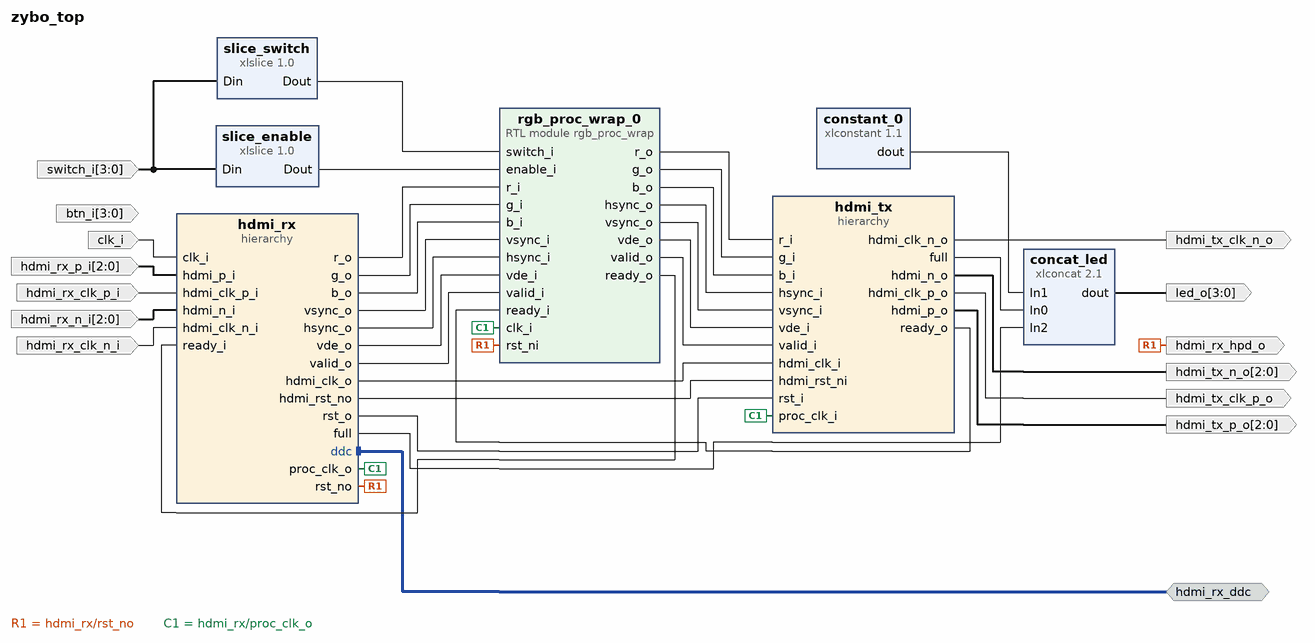
[diagram p0: block diagram of the top level]
# Vivado block design zybo_top, xc7z020clg400-1, Vivado 2017.2
create_bd_design zybo_top

create_bd_intf_port -mode Master -vlnv xilinx.com:interface:iic_rtl:1.0 hdmi_rx_ddc
create_bd_port -dir I -from 3 -to 0 switch_i
create_bd_port -dir I -from 3 -to 0 btn_i
create_bd_port -dir O -from 3 -to 0 led_o
create_bd_port -dir I -type clk clk_i
set_property -dict {CONFIG.FREQ_HZ 125000000} [get_bd_ports clk_i]
create_bd_port -dir I -from 2 -to 0 hdmi_rx_p_i
create_bd_port -dir I hdmi_rx_clk_p_i
create_bd_port -dir I -from 2 -to 0 hdmi_rx_n_i
create_bd_port -dir I hdmi_rx_clk_n_i
create_bd_port -dir O hdmi_rx_hpd_o
create_bd_port -dir O hdmi_tx_clk_n_o
create_bd_port -dir O -from 2 -to 0 hdmi_tx_n_o
create_bd_port -dir O -from 2 -to 0 hdmi_tx_p_o
create_bd_port -dir O hdmi_tx_clk_p_o

create_bd_cell -type hier hdmi_rx
create_bd_cell -type hier hdmi_tx
create_bd_cell -type ip -vlnv xilinx.com:ip:xlconcat:2.1 concat_led
set_property -dict {CONFIG.NUM_PORTS 3 CONFIG.IN1_WIDTH 2} [get_bd_cells concat_led]
create_bd_cell -type ip -vlnv xilinx.com:ip:xlconstant:1.1 constant_0
set_property -dict {CONFIG.CONST_WIDTH 2 CONFIG.CONST_VAL 0} [get_bd_cells constant_0]
create_bd_cell -type module -reference rgb_proc_wrap rgb_proc_wrap_0
create_bd_cell -type ip -vlnv xilinx.com:ip:xlslice:1.0 slice_enable
set_property -dict {CONFIG.DIN_TO 3 CONFIG.DIN_FROM 3 CONFIG.DIN_WIDTH 4 CONFIG.DOUT_WIDTH 1} [get_bd_cells slice_enable]
create_bd_cell -type ip -vlnv xilinx.com:ip:xlslice:1.0 slice_switch
set_property -dict {CONFIG.DIN_TO 0 CONFIG.DIN_FROM 2 CONFIG.DIN_WIDTH 4 CONFIG.DOUT_WIDTH 3} [get_bd_cells slice_switch]

# ---- hierarchy /hdmi_rx ----
current_bd_instance /hdmi_rx
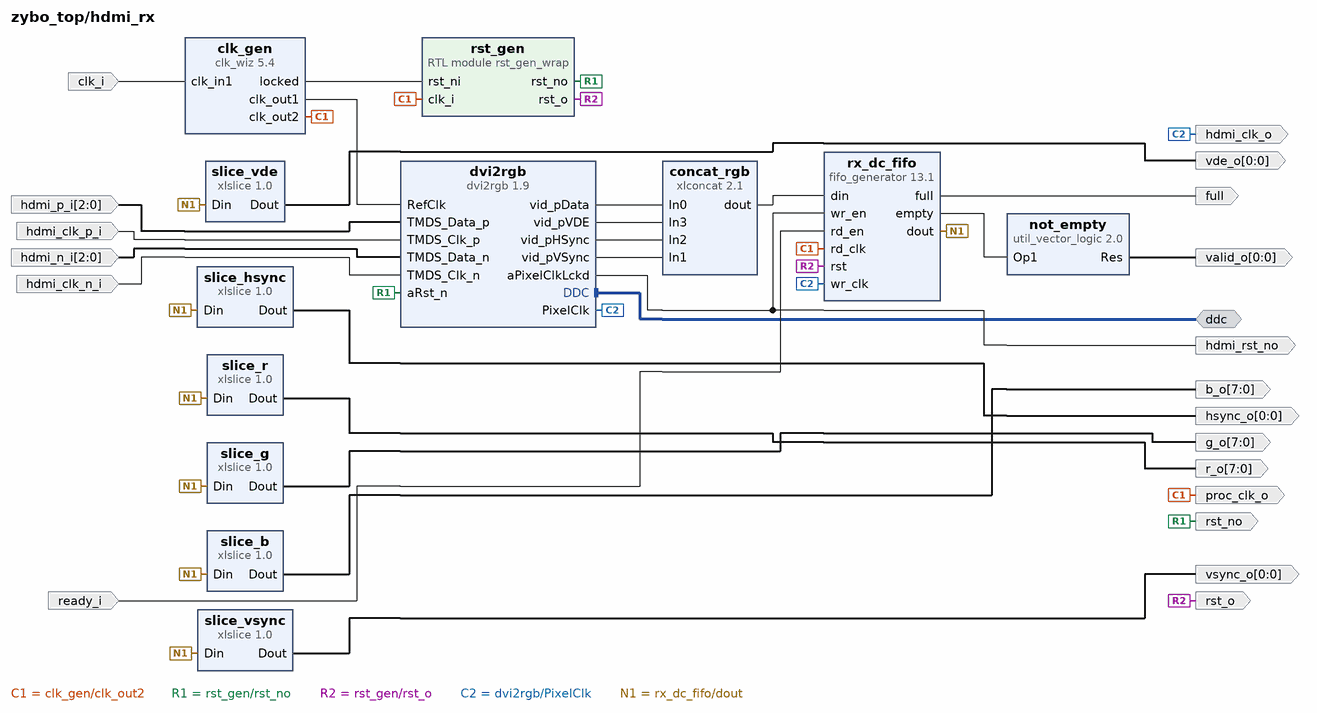
[diagram p1: block diagram inside /hdmi_rx]
create_bd_intf_pin -mode Master -vlnv xilinx.com:interface:iic_rtl:1.0 ddc
create_bd_pin -dir I clk_i
create_bd_pin -dir I -from 2 -to 0 hdmi_p_i
create_bd_pin -dir I hdmi_clk_p_i
create_bd_pin -dir I -from 2 -to 0 hdmi_n_i
create_bd_pin -dir I hdmi_clk_n_i
create_bd_pin -dir I ready_i
create_bd_pin -dir O proc_clk_o
create_bd_pin -dir O hdmi_clk_o
create_bd_pin -dir O hdmi_rst_no
create_bd_pin -dir O -from 0 -to 0 valid_o
create_bd_pin -dir O rst_o
create_bd_pin -dir O rst_no
create_bd_pin -dir O -from 7 -to 0 r_o
create_bd_pin -dir O -from 7 -to 0 g_o
create_bd_pin -dir O -from 7 -to 0 b_o
create_bd_pin -dir O -from 0 -to 0 vsync_o
create_bd_pin -dir O -from 0 -to 0 hsync_o
create_bd_pin -dir O -from 0 -to 0 vde_o
create_bd_pin -dir O full

create_bd_cell -type ip -vlnv xilinx.com:ip:clk_wiz:5.4 clk_gen
set_property -dict [list \
  CONFIG.PRIMITIVE PLL \
  CONFIG.PRIM_IN_FREQ 125 \
  CONFIG.CLKIN1_JITTER_PS 80.0 \
  CONFIG.CLKOUT2_USED true \
  CONFIG.NUM_OUT_CLKS 2 \
  CONFIG.CLKOUT1_REQUESTED_OUT_FREQ 200.000 \
  CONFIG.CLKOUT2_REQUESTED_OUT_FREQ 150.000 \
  CONFIG.CLKOUT1_DRIVES BUFG \
  CONFIG.FEEDBACK_SOURCE FDBK_AUTO \
  CONFIG.USE_RESET false \
  CONFIG.MMCM_DIVCLK_DIVIDE 5 \
  CONFIG.MMCM_CLKFBOUT_MULT_F 48 \
  CONFIG.MMCM_CLKIN1_PERIOD 8.000 \
  CONFIG.MMCM_CLKIN2_PERIOD 10.000 \
  CONFIG.MMCM_COMPENSATION ZHOLD \
  CONFIG.MMCM_CLKOUT0_DIVIDE_F 6 \
  CONFIG.CLKOUT1_JITTER 161.296 \
  CONFIG.CLKOUT1_PHASE_ERROR 222.305 \
  CONFIG.CLKOUT2_JITTER 168.006 \
  CONFIG.CLKOUT2_PHASE_ERROR 222.305 \
] [get_bd_cells clk_gen]
create_bd_cell -type module -reference rst_gen_wrap rst_gen
create_bd_cell -type ip -vlnv digilentinc.com:ip:dvi2rgb:1.9 dvi2rgb
set_property -dict {CONFIG.kRstActiveHigh false CONFIG.kClkRange 1 CONFIG.kEdidFileName dgl_1080p_cea.data} [get_bd_cells dvi2rgb]
create_bd_cell -type ip -vlnv xilinx.com:ip:xlconcat:2.1 concat_rgb
set_property -dict {CONFIG.NUM_PORTS 4 CONFIG.IN0_WIDTH 24} [get_bd_cells concat_rgb]
create_bd_cell -type ip -vlnv xilinx.com:ip:xlslice:1.0 slice_r
set_property -dict {CONFIG.DIN_TO 16 CONFIG.DIN_FROM 23 CONFIG.DIN_WIDTH 27 CONFIG.DOUT_WIDTH 8} [get_bd_cells slice_r]
create_bd_cell -type ip -vlnv xilinx.com:ip:xlslice:1.0 slice_hsync
set_property -dict {CONFIG.DIN_TO 25 CONFIG.DIN_FROM 25 CONFIG.DIN_WIDTH 27 CONFIG.DOUT_WIDTH 1} [get_bd_cells slice_hsync]
create_bd_cell -type ip -vlnv xilinx.com:ip:xlslice:1.0 slice_vsync
set_property -dict {CONFIG.DIN_TO 24 CONFIG.DIN_FROM 24 CONFIG.DIN_WIDTH 27 CONFIG.DOUT_WIDTH 1} [get_bd_cells slice_vsync]
create_bd_cell -type ip -vlnv xilinx.com:ip:xlslice:1.0 slice_vde
set_property -dict {CONFIG.DIN_TO 26 CONFIG.DIN_FROM 26 CONFIG.DIN_WIDTH 27 CONFIG.DOUT_WIDTH 1} [get_bd_cells slice_vde]
create_bd_cell -type ip -vlnv xilinx.com:ip:xlslice:1.0 slice_g
set_property -dict {CONFIG.DIN_TO 8 CONFIG.DIN_FROM 15 CONFIG.DIN_WIDTH 27 CONFIG.DOUT_WIDTH 8} [get_bd_cells slice_g]
create_bd_cell -type ip -vlnv xilinx.com:ip:xlslice:1.0 slice_b
set_property -dict {CONFIG.DIN_TO 0 CONFIG.DIN_FROM 7 CONFIG.DIN_WIDTH 27 CONFIG.DOUT_WIDTH 8} [get_bd_cells slice_b]
create_bd_cell -type ip -vlnv xilinx.com:ip:fifo_generator:13.1 rx_dc_fifo
set_property -dict [list \
  CONFIG.Fifo_Implementation Independent_Clocks_Builtin_FIFO \
  CONFIG.Input_Data_Width 27 \
  CONFIG.Input_Depth 512 \
  CONFIG.Read_Clock_Frequency 150 \
  CONFIG.Write_Clock_Frequency 100 \
] [get_bd_cells rx_dc_fifo]
create_bd_cell -type ip -vlnv xilinx.com:ip:util_vector_logic:2.0 not_empty
set_property -dict {CONFIG.C_SIZE 1 CONFIG.C_OPERATION not} [get_bd_cells not_empty]

# ---- hierarchy /hdmi_tx ----
current_bd_instance /hdmi_tx
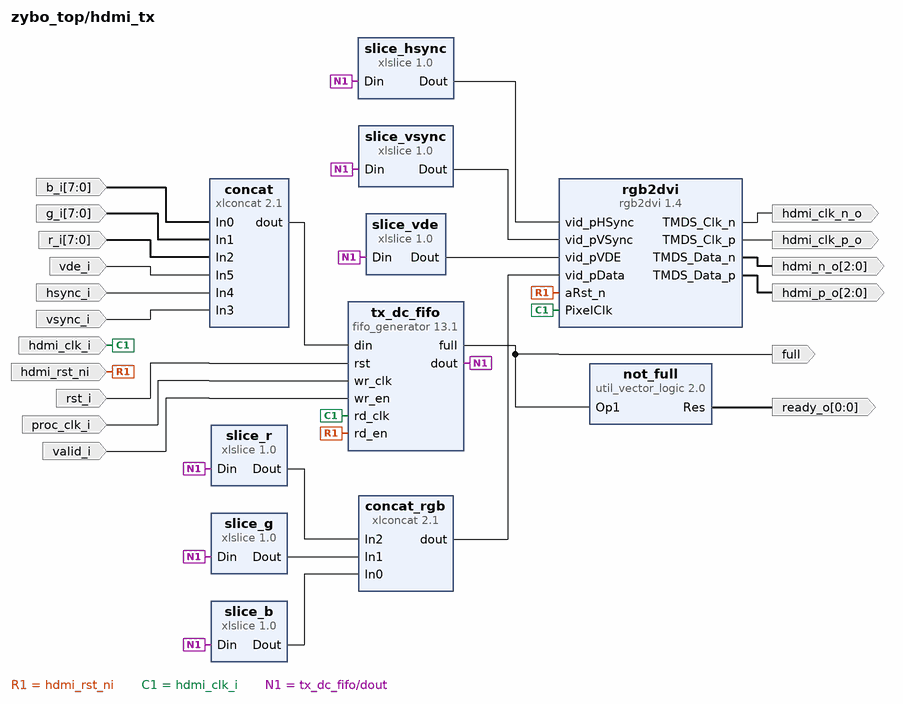
[diagram p2: block diagram inside /hdmi_tx]
create_bd_pin -dir I rst_i
create_bd_pin -dir I proc_clk_i
create_bd_pin -dir I hdmi_clk_i
create_bd_pin -dir I hdmi_rst_ni
create_bd_pin -dir I -from 7 -to 0 r_i
create_bd_pin -dir I -from 7 -to 0 g_i
create_bd_pin -dir I -from 7 -to 0 b_i
create_bd_pin -dir I vsync_i
create_bd_pin -dir I hsync_i
create_bd_pin -dir I vde_i
create_bd_pin -dir I valid_i
create_bd_pin -dir O -from 0 -to 0 ready_o
create_bd_pin -dir O hdmi_clk_n_o
create_bd_pin -dir O -from 2 -to 0 hdmi_n_o
create_bd_pin -dir O hdmi_clk_p_o
create_bd_pin -dir O -from 2 -to 0 hdmi_p_o
create_bd_pin -dir O full

create_bd_cell -type ip -vlnv digilentinc.com:ip:rgb2dvi:1.4 rgb2dvi
set_property -dict {CONFIG.kRstActiveHigh false CONFIG.kClkPrimitive MMCM} [get_bd_cells rgb2dvi]
create_bd_cell -type ip -vlnv xilinx.com:ip:xlconcat:2.1 concat
set_property -dict {CONFIG.NUM_PORTS 6 CONFIG.IN0_WIDTH 8 CONFIG.IN1_WIDTH 8 CONFIG.IN2_WIDTH 8} [get_bd_cells concat]
create_bd_cell -type ip -vlnv xilinx.com:ip:xlslice:1.0 slice_vde
set_property -dict {CONFIG.DIN_TO 26 CONFIG.DIN_FROM 26 CONFIG.DIN_WIDTH 27 CONFIG.DOUT_WIDTH 1} [get_bd_cells slice_vde]
create_bd_cell -type ip -vlnv xilinx.com:ip:xlslice:1.0 slice_hsync
set_property -dict {CONFIG.DIN_TO 25 CONFIG.DIN_FROM 25 CONFIG.DIN_WIDTH 27 CONFIG.DOUT_WIDTH 1} [get_bd_cells slice_hsync]
create_bd_cell -type ip -vlnv xilinx.com:ip:xlslice:1.0 slice_vsync
set_property -dict {CONFIG.DIN_TO 24 CONFIG.DIN_FROM 24 CONFIG.DIN_WIDTH 27 CONFIG.DOUT_WIDTH 1} [get_bd_cells slice_vsync]
create_bd_cell -type ip -vlnv xilinx.com:ip:xlslice:1.0 slice_r
set_property -dict {CONFIG.DIN_TO 16 CONFIG.DIN_FROM 23 CONFIG.DIN_WIDTH 27 CONFIG.DOUT_WIDTH 8} [get_bd_cells slice_r]
create_bd_cell -type ip -vlnv xilinx.com:ip:xlslice:1.0 slice_g
set_property -dict {CONFIG.DIN_TO 8 CONFIG.DIN_FROM 15 CONFIG.DIN_WIDTH 27 CONFIG.DOUT_WIDTH 8} [get_bd_cells slice_g]
create_bd_cell -type ip -vlnv xilinx.com:ip:xlslice:1.0 slice_b
set_property -dict {CONFIG.DIN_TO 0 CONFIG.DIN_FROM 7 CONFIG.DIN_WIDTH 27 CONFIG.DOUT_WIDTH 8} [get_bd_cells slice_b]
create_bd_cell -type ip -vlnv xilinx.com:ip:xlconcat:2.1 concat_rgb
set_property -dict {CONFIG.NUM_PORTS 3 CONFIG.IN0_WIDTH 8 CONFIG.IN1_WIDTH 8 CONFIG.IN2_WIDTH 8} [get_bd_cells concat_rgb]
create_bd_cell -type ip -vlnv xilinx.com:ip:fifo_generator:13.1 tx_dc_fifo
set_property -dict [list \
  CONFIG.Fifo_Implementation Independent_Clocks_Builtin_FIFO \
  CONFIG.Input_Data_Width 27 \
  CONFIG.Input_Depth 512 \
  CONFIG.Read_Clock_Frequency 100 \
  CONFIG.Write_Clock_Frequency 150 \
] [get_bd_cells tx_dc_fifo]
create_bd_cell -type ip -vlnv xilinx.com:ip:util_vector_logic:2.0 not_full
set_property -dict {CONFIG.C_SIZE 1 CONFIG.C_OPERATION not} [get_bd_cells not_full]

# ---- connections ----

current_bd_instance /hdmi_rx
connect_bd_intf_net [get_bd_intf_pins ddc] [get_bd_intf_pins dvi2rgb/DDC]
connect_bd_net [get_bd_pins clk_i] [get_bd_pins clk_gen/clk_in1]
connect_bd_net [get_bd_pins clk_gen/clk_out2] [get_bd_pins proc_clk_o] [get_bd_pins rst_gen/clk_i] [get_bd_pins rx_dc_fifo/rd_clk]
connect_bd_net [get_bd_pins clk_gen/locked] [get_bd_pins rst_gen/rst_ni]
connect_bd_net [get_bd_pins clk_gen/clk_out1] [get_bd_pins dvi2rgb/RefClk]
connect_bd_net [get_bd_pins rst_gen/rst_no] [get_bd_pins rst_no] [get_bd_pins dvi2rgb/aRst_n]
connect_bd_net [get_bd_pins hdmi_p_i] [get_bd_pins dvi2rgb/TMDS_Data_p]
connect_bd_net [get_bd_pins hdmi_clk_p_i] [get_bd_pins dvi2rgb/TMDS_Clk_p]
connect_bd_net [get_bd_pins hdmi_n_i] [get_bd_pins dvi2rgb/TMDS_Data_n]
connect_bd_net [get_bd_pins hdmi_clk_n_i] [get_bd_pins dvi2rgb/TMDS_Clk_n]
connect_bd_net [get_bd_pins rst_gen/rst_o] [get_bd_pins rst_o] [get_bd_pins rx_dc_fifo/rst]
connect_bd_net [get_bd_pins dvi2rgb/vid_pData] [get_bd_pins concat_rgb/In0]
connect_bd_net [get_bd_pins dvi2rgb/vid_pVDE] [get_bd_pins concat_rgb/In3]
connect_bd_net [get_bd_pins dvi2rgb/vid_pHSync] [get_bd_pins concat_rgb/In2]
connect_bd_net [get_bd_pins dvi2rgb/vid_pVSync] [get_bd_pins concat_rgb/In1]
connect_bd_net -net vde_slice_Dout [get_bd_pins slice_vde/Dout] [get_bd_pins vde_o]
connect_bd_net -net hsync_slice_Dout [get_bd_pins slice_hsync/Dout] [get_bd_pins hsync_o]
connect_bd_net -net r_slice_Dout [get_bd_pins slice_r/Dout] [get_bd_pins r_o]
connect_bd_net -net g_slice_Dout [get_bd_pins slice_g/Dout] [get_bd_pins g_o]
connect_bd_net -net b_slice_Dout [get_bd_pins slice_b/Dout] [get_bd_pins b_o]
connect_bd_net -net vsync_slice_Dout [get_bd_pins slice_vsync/Dout] [get_bd_pins vsync_o]
connect_bd_net [get_bd_pins dvi2rgb/PixelClk] [get_bd_pins hdmi_clk_o] [get_bd_pins rx_dc_fifo/wr_clk]
connect_bd_net [get_bd_pins dvi2rgb/aPixelClkLckd] [get_bd_pins hdmi_rst_no] [get_bd_pins rx_dc_fifo/wr_en]
connect_bd_net [get_bd_pins concat_rgb/dout] [get_bd_pins rx_dc_fifo/din]
connect_bd_net [get_bd_pins rx_dc_fifo/dout] \
  [get_bd_pins slice_b/Din] [get_bd_pins slice_g/Din] [get_bd_pins slice_hsync/Din] [get_bd_pins slice_r/Din] \
  [get_bd_pins slice_vde/Din] [get_bd_pins slice_vsync/Din]
connect_bd_net [get_bd_pins ready_i] [get_bd_pins rx_dc_fifo/rd_en]
connect_bd_net [get_bd_pins rx_dc_fifo/empty] [get_bd_pins not_empty/Op1]
connect_bd_net [get_bd_pins not_empty/Res] [get_bd_pins valid_o]
connect_bd_net [get_bd_pins rx_dc_fifo/full] [get_bd_pins full]

current_bd_instance /hdmi_tx
connect_bd_net [get_bd_pins hdmi_rst_ni] [get_bd_pins rgb2dvi/aRst_n] [get_bd_pins tx_dc_fifo/rd_en]
connect_bd_net [get_bd_pins hdmi_clk_i] [get_bd_pins rgb2dvi/PixelClk] [get_bd_pins tx_dc_fifo/rd_clk]
connect_bd_net [get_bd_pins b_i] [get_bd_pins concat/In0]
connect_bd_net [get_bd_pins g_i] [get_bd_pins concat/In1]
connect_bd_net [get_bd_pins r_i] [get_bd_pins concat/In2]
connect_bd_net [get_bd_pins vde_i] [get_bd_pins concat/In5]
connect_bd_net [get_bd_pins hsync_i] [get_bd_pins concat/In4]
connect_bd_net [get_bd_pins vsync_i] [get_bd_pins concat/In3]
connect_bd_net [get_bd_pins slice_r/Dout] [get_bd_pins concat_rgb/In2]
connect_bd_net [get_bd_pins slice_g/Dout] [get_bd_pins concat_rgb/In1]
connect_bd_net [get_bd_pins slice_b/Dout] [get_bd_pins concat_rgb/In0]
connect_bd_net [get_bd_pins concat_rgb/dout] [get_bd_pins rgb2dvi/vid_pData]
connect_bd_net [get_bd_pins slice_hsync/Dout] [get_bd_pins rgb2dvi/vid_pHSync]
connect_bd_net [get_bd_pins slice_vsync/Dout] [get_bd_pins rgb2dvi/vid_pVSync]
connect_bd_net [get_bd_pins slice_vde/Dout] [get_bd_pins rgb2dvi/vid_pVDE]
connect_bd_net [get_bd_pins rgb2dvi/TMDS_Clk_p] [get_bd_pins hdmi_clk_p_o]
connect_bd_net [get_bd_pins rgb2dvi/TMDS_Clk_n] [get_bd_pins hdmi_clk_n_o]
connect_bd_net [get_bd_pins rgb2dvi/TMDS_Data_p] [get_bd_pins hdmi_p_o]
connect_bd_net [get_bd_pins rgb2dvi/TMDS_Data_n] [get_bd_pins hdmi_n_o]
connect_bd_net [get_bd_pins concat/dout] [get_bd_pins tx_dc_fifo/din]
connect_bd_net [get_bd_pins tx_dc_fifo/dout] \
  [get_bd_pins slice_b/Din] [get_bd_pins slice_g/Din] [get_bd_pins slice_r/Din] [get_bd_pins slice_hsync/Din] \
  [get_bd_pins slice_vsync/Din] [get_bd_pins slice_vde/Din]
connect_bd_net [get_bd_pins rst_i] [get_bd_pins tx_dc_fifo/rst]
connect_bd_net [get_bd_pins proc_clk_i] [get_bd_pins tx_dc_fifo/wr_clk]
connect_bd_net [get_bd_pins valid_i] [get_bd_pins tx_dc_fifo/wr_en]
connect_bd_net [get_bd_pins tx_dc_fifo/full] [get_bd_pins not_full/Op1] [get_bd_pins full]
connect_bd_net [get_bd_pins not_full/Res] [get_bd_pins ready_o]

current_bd_instance /
connect_bd_intf_net [get_bd_intf_ports hdmi_rx_ddc] [get_bd_intf_pins hdmi_rx/ddc]
connect_bd_net [get_bd_ports clk_i] [get_bd_pins hdmi_rx/clk_i]
connect_bd_net [get_bd_ports hdmi_rx_p_i] [get_bd_pins hdmi_rx/hdmi_p_i]
connect_bd_net [get_bd_ports hdmi_rx_clk_p_i] [get_bd_pins hdmi_rx/hdmi_clk_p_i]
connect_bd_net [get_bd_ports hdmi_rx_n_i] [get_bd_pins hdmi_rx/hdmi_n_i]
connect_bd_net [get_bd_ports hdmi_rx_clk_n_i] [get_bd_pins hdmi_rx/hdmi_clk_n_i]
connect_bd_net [get_bd_pins hdmi_rx/rst_no] [get_bd_ports hdmi_rx_hpd_o] [get_bd_pins rgb_proc_wrap_0/rst_ni]
connect_bd_net [get_bd_pins hdmi_tx/hdmi_clk_n_o] [get_bd_ports hdmi_tx_clk_n_o]
connect_bd_net [get_bd_pins hdmi_tx/hdmi_n_o] [get_bd_ports hdmi_tx_n_o]
connect_bd_net [get_bd_pins hdmi_tx/hdmi_p_o] [get_bd_ports hdmi_tx_p_o]
connect_bd_net [get_bd_pins hdmi_tx/hdmi_clk_p_o] [get_bd_ports hdmi_tx_clk_p_o]
connect_bd_net -net proc_clk_i_1 [get_bd_pins hdmi_rx/proc_clk_o] [get_bd_pins hdmi_tx/proc_clk_i] [get_bd_pins rgb_proc_wrap_0/clk_i]
connect_bd_net -net hdmi_clk_i_1 [get_bd_pins hdmi_rx/hdmi_clk_o] [get_bd_pins hdmi_tx/hdmi_clk_i]
connect_bd_net -net hdmi_rst_ni_1 [get_bd_pins hdmi_rx/hdmi_rst_no] [get_bd_pins hdmi_tx/hdmi_rst_ni]
connect_bd_net [get_bd_pins hdmi_rx/rst_o] [get_bd_pins hdmi_tx/rst_i]
connect_bd_net [get_bd_pins hdmi_tx/full] [get_bd_pins concat_led/In0]
connect_bd_net [get_bd_pins hdmi_rx/full] [get_bd_pins concat_led/In2]
connect_bd_net -net xlconstant_0_dout [get_bd_pins constant_0/dout] [get_bd_pins concat_led/In1]
connect_bd_net [get_bd_pins hdmi_rx/r_o] [get_bd_pins rgb_proc_wrap_0/r_i]
connect_bd_net [get_bd_pins hdmi_rx/g_o] [get_bd_pins rgb_proc_wrap_0/g_i]
connect_bd_net [get_bd_pins hdmi_rx/b_o] [get_bd_pins rgb_proc_wrap_0/b_i]
connect_bd_net [get_bd_pins hdmi_rx/vsync_o] [get_bd_pins rgb_proc_wrap_0/vsync_i]
connect_bd_net [get_bd_pins hdmi_rx/hsync_o] [get_bd_pins rgb_proc_wrap_0/hsync_i]
connect_bd_net [get_bd_pins hdmi_rx/vde_o] [get_bd_pins rgb_proc_wrap_0/vde_i]
connect_bd_net [get_bd_pins hdmi_rx/valid_o] [get_bd_pins rgb_proc_wrap_0/valid_i]
connect_bd_net [get_bd_pins rgb_proc_wrap_0/ready_o] [get_bd_pins hdmi_rx/ready_i]
connect_bd_net [get_bd_pins hdmi_tx/ready_o] [get_bd_pins rgb_proc_wrap_0/ready_i]
connect_bd_net -net r_i_1 [get_bd_pins rgb_proc_wrap_0/r_o] [get_bd_pins hdmi_tx/r_i]
connect_bd_net [get_bd_pins rgb_proc_wrap_0/g_o] [get_bd_pins hdmi_tx/g_i]
connect_bd_net -net b_i_1 [get_bd_pins rgb_proc_wrap_0/b_o] [get_bd_pins hdmi_tx/b_i]
connect_bd_net [get_bd_pins rgb_proc_wrap_0/hsync_o] [get_bd_pins hdmi_tx/hsync_i]
connect_bd_net -net vsync_i_1 [get_bd_pins rgb_proc_wrap_0/vsync_o] [get_bd_pins hdmi_tx/vsync_i]
connect_bd_net [get_bd_pins rgb_proc_wrap_0/vde_o] [get_bd_pins hdmi_tx/vde_i]
connect_bd_net -net valid_i_1 [get_bd_pins rgb_proc_wrap_0/valid_o] [get_bd_pins hdmi_tx/valid_i]
connect_bd_net [get_bd_ports switch_i] [get_bd_pins slice_enable/Din] [get_bd_pins slice_switch/Din]
connect_bd_net [get_bd_pins slice_enable/Dout] [get_bd_pins rgb_proc_wrap_0/enable_i]
connect_bd_net [get_bd_pins slice_switch/Dout] [get_bd_pins rgb_proc_wrap_0/switch_i]
connect_bd_net [get_bd_pins concat_led/dout] [get_bd_ports led_o]

validate_bd_design
save_bd_design
